# EAGLE design URC-ESP32 (EAGLE 9.6.2)

## Sheet 1 of 3
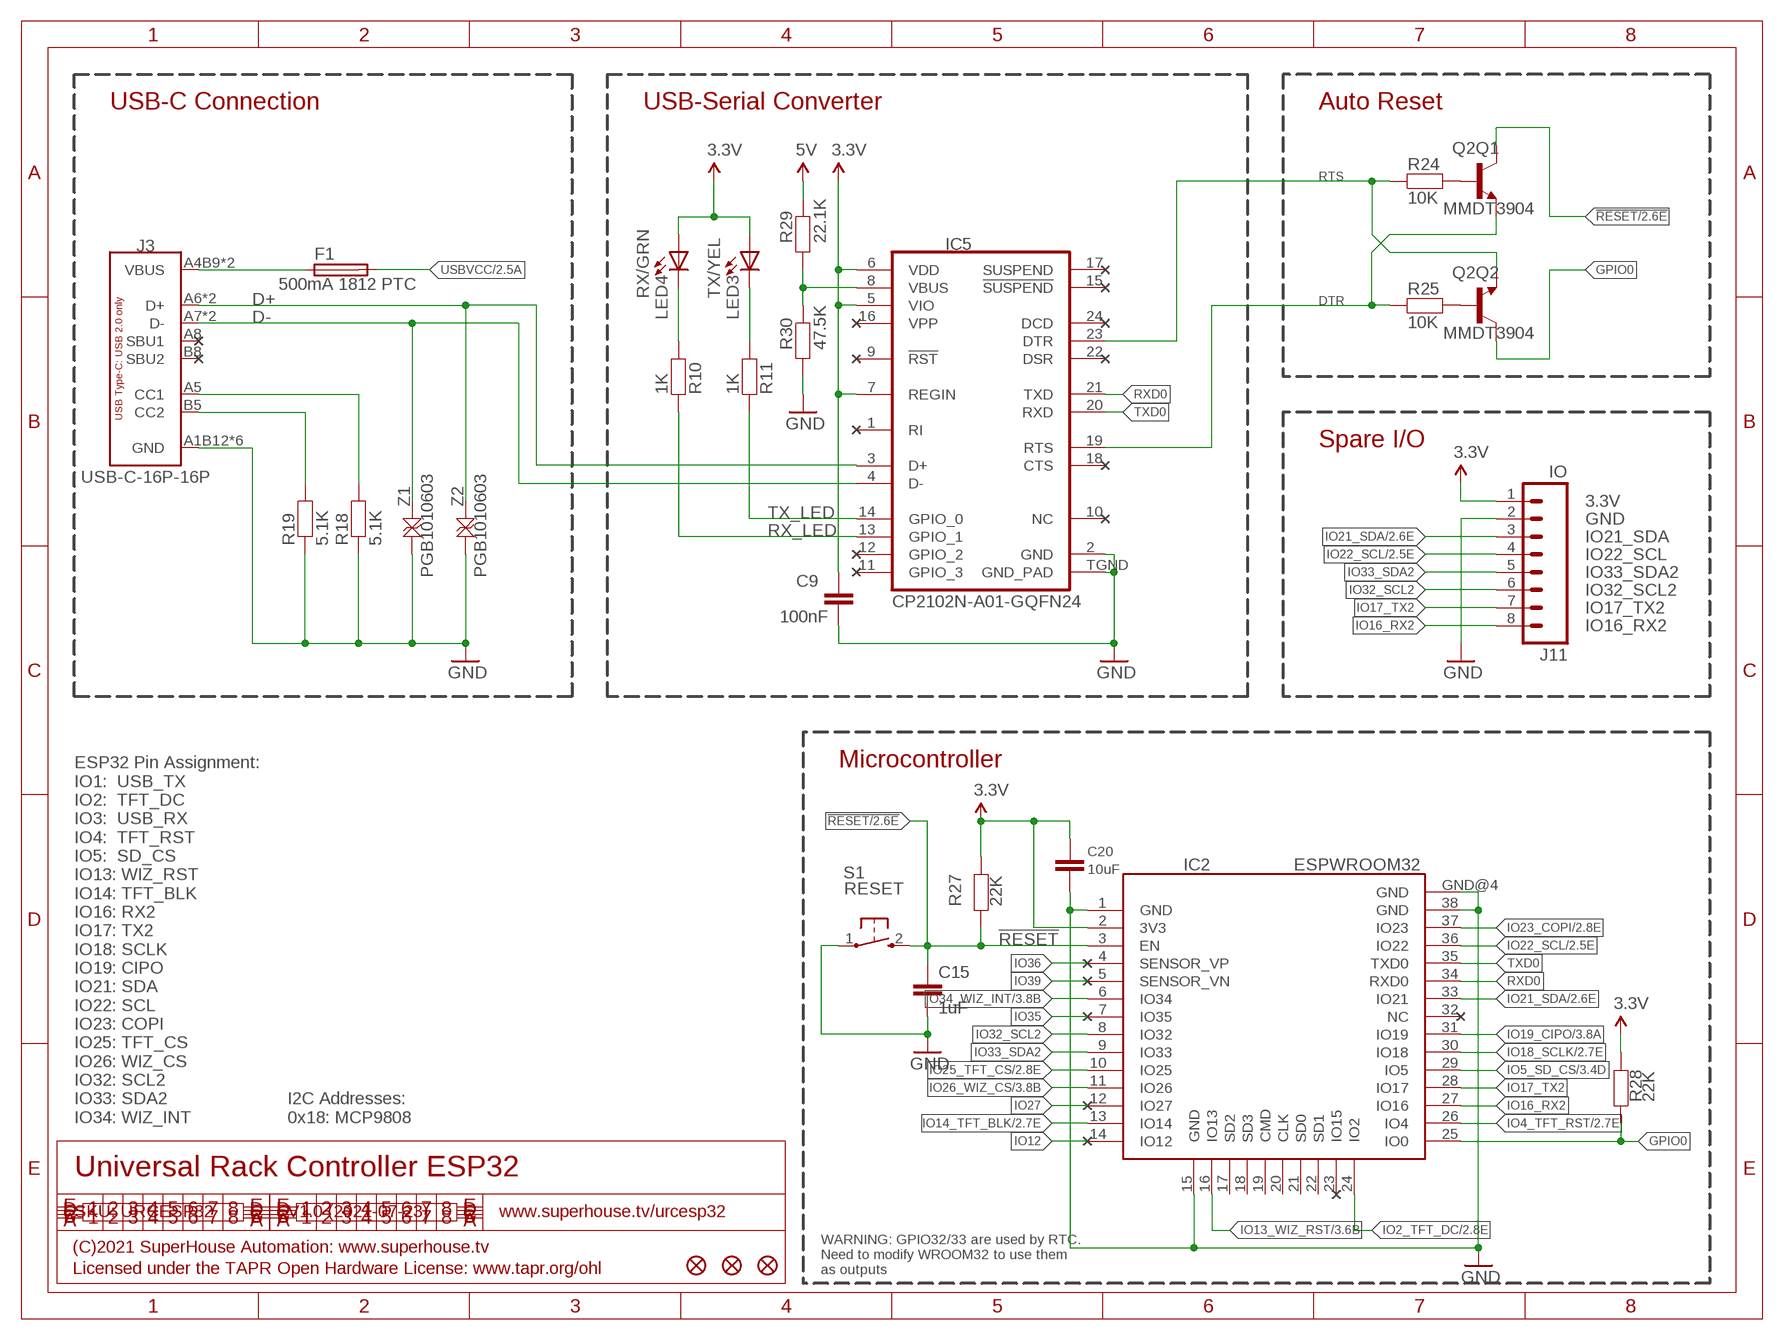
[diagram p0: schematic, sheet 1]

### Parts
C9  100nF  CAP0603  [C0603]
C15  1uF  CAP0603  [C0603]
C20  10uF  CAP0805  [C0805]
F1  500mA 1812 PTC  PTC050-1812  [1812]
FID1  FIDUCIAL1X2.5  [FIDUCIAL-1X2.5]
FID2  FIDUCIAL1X2.5  [FIDUCIAL-1X2.5]
FID3  FIDUCIAL1X2.5  [FIDUCIAL-1X2.5]
IC2  ESPWROOM32  [ESPWROOM32]
IC5  CP2102N-A01-GQFN24  CP2104  [QFN-24]
J3  USB-C-16P-16P  [USB-C-16P]
J11  IO  M08-PLAIN  [1X08]
LED3  TX/YEL  LED0603  [LED-0603]
LED4  RX/GRN  LED0603  [LED-0603]
Q2  MMDT3904  TRANS_NPN_DUAL-MMDT3904  [SOT-363]
R10  1K  RESISTOR0603  [R0603]
R11  1K  RESISTOR0603  [R0603]
R18  5.1K  RESISTOR0603  [R0603]
R19  5.1K  RESISTOR0603  [R0603]
R24  10K  RESISTOR0603  [R0603]
R25  10K  RESISTOR0603  [R0603]
R27  22K  RESISTOR0603  [R0603]
R28  22K  RESISTOR0603  [R0603]
R29  22.1K  RESISTOR0603  [R0603]
R30  47.5K  RESISTOR0603  [R0603]
S1  RESET  TAC_SWITCH_2PINSMT  [TACTILE_SMT_3X4X2]
Z1  PGB1010603  TVS0603  [TVS0603]
Z2  PGB1010603  TVS0603  [TVS0603]

### Nets
3.3V: C9.1 C20.1 IC2.2(3V3) IC5.5(VIO) IC5.6(VDD) IC5.7(REGIN) J11.1 LED3.A LED4.A R27.1 R28.1 ; also sheet 2,3
5V [power]: R29.2 ; also sheet 2
!RESET: C15.1 IC2.3(EN) Q2.3(Q1:C) R27.2 S1.2(S) ; also sheet 2
D+: IC5.3(D+) J3.A6(D+) J3.B6(D+) Z2.2
D-: IC5.4(D-) J3.A7(D-) J3.B7(D-) Z1.2
DTR: IC5.23(DTR) Q2.1(Q2:E) R24.1
GND: C9.2 C15.2 C20.2 IC2.1(GND) IC2.15(GND) IC2.38(GND) IC2.GND@4(GND) IC5.2(GND) IC5.TGND(GND_PAD) J3.A1B12(GND) J3.A12B1(GND) J3.FIX1(GND) J3.FIX2(GND) J3.FIX3(GND) J3.FIX4(GND) J11.2 R18.1 R19.1 R30.1 S1.1(P) Z1.1 Z2.1 ; also sheet 2,3
GPIO0: IC2.25(IO0) Q2.6(Q2:C) R28.2
IO2_TFT_DC: IC2.24(IO2) ; also sheet 2
IO4_TFT_RST: IC2.26(IO4) ; also sheet 2
IO5_SD_CS: IC2.29(IO5) ; also sheet 3
IO12: IC2.14(IO12)
IO13_WIZ_RST: IC2.16(IO13) ; also sheet 3
IO14_TFT_BLK: IC2.13(IO14) ; also sheet 2
IO16_RX2: IC2.27(IO16) J11.8
IO17_TX2: IC2.28(IO17) J11.7
IO18_SCLK: IC2.30(IO18) ; also sheet 2,3
IO19_CIPO: IC2.31(IO19) ; also sheet 3
IO21_SDA: IC2.33(IO21) J11.3 ; also sheet 2
IO22_SCL: IC2.36(IO22) J11.4 ; also sheet 2
IO23_COPI: IC2.37(IO23) ; also sheet 2,3
IO25_TFT_CS: IC2.10(IO25) ; also sheet 2
IO26_WIZ_CS: IC2.11(IO26) ; also sheet 3
IO27: IC2.12(IO27)
IO32_SCL2: IC2.8(IO32) J11.6
IO33_SDA2: IC2.9(IO33) J11.5
IO34_WIZ_INT: IC2.6(IO34) ; also sheet 3
IO35: IC2.7(IO35)
IO36: IC2.4(SENSOR_VP)
IO39: IC2.5(SENSOR_VN)
N$3: Q2.2(Q2:B) R25.2
N$4: J3.B5(CC2) R19.2
N$6: J3.A5(CC1) R18.2
N$7: Q2.5(Q1:B) R24.2
N$21: LED3.C R11.2
N$22: LED4.C R10.2
N$45: IC5.8(VBUS) R29.1 R30.2
RTS: IC5.19(RTS) Q2.4(Q1:E) R25.1
RX_LED: IC5.13(GPIO_1) R10.1
RXD0: IC2.34(RXD0) IC5.21(TXD)
TX_LED: IC5.14(GPIO_0) R11.1
TXD0: IC2.35(TXD0) IC5.20(RXD)
USBVCC: F1.2 ; also sheet 2
USBVIN: F1.1 J3.A4B9(VBUS) J3.A9B4(VBUS)
Unconnected: IC2.17(SD2) IC2.18(SD3) IC2.19(CMD) IC2.20(CLK) IC2.21(SD0) IC2.22(SD1) IC2.23(IO15) IC2.32(NC) IC5.1(RI) IC5.9(!RST) IC5.10(NC) IC5.11(GPIO_3) IC5.12(GPIO_2) IC5.15(!SUSPEND) IC5.16(VPP) IC5.17(SUSPEND) IC5.18(CTS) IC5.22(DSR) IC5.24(DCD) J3.A8(SBU1) J3.B8(SBU2)

### Notes on the sheet
- USB-C Connection | USB-Serial Converter | Auto Reset
- Spare I/O
- 3.3V
- GND
- IO21_SDA
- IO22_SCL
- IO33_SDA2
- IO32_SCL2
- IO17_TX2
- IO16_RX2
- Microcontroller
- ESP32 Pin Assignment:
  IO1:  USB_TX
  IO2:  TFT_DC
  IO3:  USB_RX
  IO4:  TFT_RST
  IO5:  SD_CS
  IO13: WIZ_RST
  IO14: TFT_BLK
  IO16: RX2
  IO17: TX2
  IO18: SCLK
  IO19: CIPO
  IO21: SDA
  IO22: SCL
  IO23: COPI
  IO25: TFT_CS
  IO26: WIZ_CS
  IO32: SCL2
  IO33: SDA2
  IO34: WIZ_INT
- I2C Addresses:
  0x18: MCP9808
- Universal Rack Controller ESP32
- SKU: URCESP32 | V1.0 (2021-07-23) | www.superhouse.tv/urcesp32
- (C)2021 SuperHouse Automation: www.superhouse.tv
- Licensed under the TAPR Open Hardware License: www.tapr.org/ohl
- WARNING: GPIO32/33 are used by RTC.
  Need to modify WROOM32 to use them
  as outputs

## Sheet 2 of 3
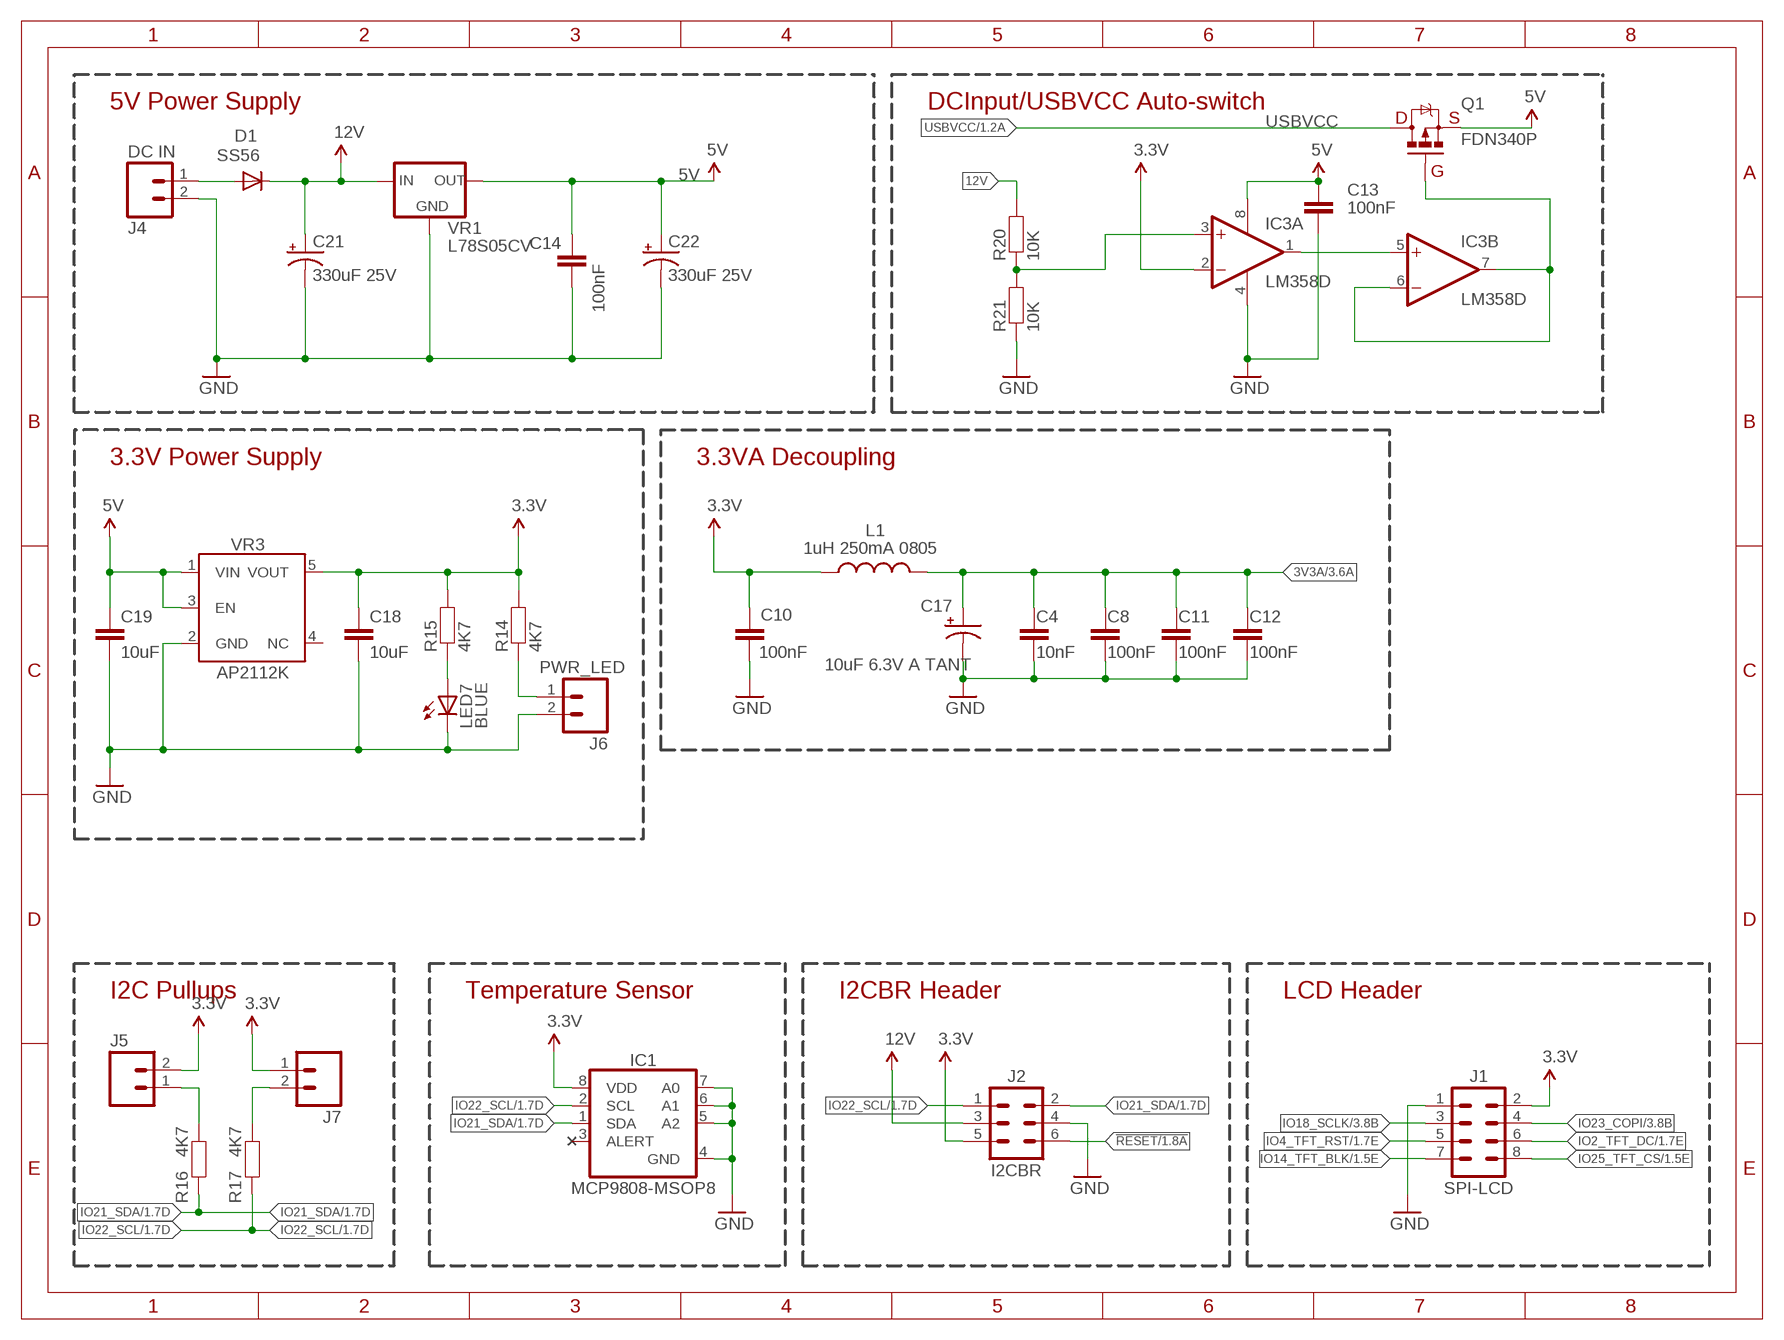
[diagram p1: schematic, sheet 2]

### Parts
C4  10nF  CAP0603  [C0603]
C8  100nF  CAP0603  [C0603]
C10  100nF  CAP0603  [C0603]
C11  100nF  CAP0603  [C0603]
C12  100nF  CAP0603  [C0603]
C13  100nF  CAP0603  [C0603]
C14  100nF  CAP0603  [C0603]
C17  10uF 6.3V A TANT  CAP_POL1206  [EIA3216]
C18  10uF  CAP0805  [C0805]
C19  10uF  CAP0805  [C0805]
C21  330uF 25V  CAP_POLG  [PANASONIC_G]
C22  330uF 25V  CAP_POLG  [PANASONIC_G]
D1  SS56  DIODESMA  [SMA-DIODE]
IC1  MCP9808-MSOP8  [MSOP-8]
IC3  LM358D  [SO08]
J1  SPI-LCD  M02X4-SHROUD  [2X04-2.54-SHROUDED]
J2  I2CBR  M02X3-SHROUDED  [2X3-2.54-SHROUDED]
J4  DC IN  M02-SCREW-3.81MM-HOR  [SCREWTERMINAL-3.81MM-HOR-2]
J5  M02-PIN-JUMP-Y  [1X02-P-JUMP-Y]
J6  PWR_LED  M02-KF2510  [1X02-KF2510]
J7  M02-PIN-JUMP-Y  [1X02-P-JUMP-Y]
L1  1uH 250mA 0805  L-USL2012C  [L2012C]
LED7  BLUE  LED0603  [LED-0603]
Q1  FDN340P  MOSFET-PCHANNEL-SMT  [SOT23-3]
R14  4K7  RESISTOR0603  [R0603]
R15  4K7  RESISTOR0603  [R0603]
R16  4K7  RESISTOR0603  [R0603]
R17  4K7  RESISTOR0603  [R0603]
R20  10K  RESISTOR0603  [R0603]
R21  10K  RESISTOR0603  [R0603]
VR1  L78S05CV  78XX-L78XX-FLAT  [TO220]
VR3  AP2112KSOT25  [SOT23-5]

### Nets
3.3V: C10.1 C18.1 IC1.8(VDD) IC3.2(A:-IN) J1.2 J2.5 J5.2 J7.1 L1.1 R14.2 R15.2 VR3.5(VOUT) ; also sheet 1,3
3V3A: C4.1 C8.1 C11.1 C12.1 C17.A(+) L1.2 ; also sheet 3
5V [power]: C13.1 C14.1 C19.1 C22.+ IC3.8(P:V+) Q1.2(S) VR1.3(OUT) VR3.1(VIN) VR3.3(EN) ; also sheet 1
12V: C21.+ D1.C J2.3 R20.2 VR1.1(IN) ; also sheet 3
!RESET: J2.6 ; also sheet 1
GND: C4.2 C8.2 C10.2 C11.2 C12.2 C13.2 C14.2 C17.C(-) C18.2 C19.2 C21.- C22.- IC1.4(GND) IC1.5(A2) IC1.6(A1) IC1.7(A0) IC3.4(P:V-) J1.1 J2.4 J4.2 J6.2 LED7.C R21.1 VR1.2(GND) VR1.HEATSINK(GND) VR1.TAB(GND) VR3.2(GND) ; also sheet 1,3
IO2_TFT_DC: J1.6 ; also sheet 1
IO4_TFT_RST: J1.5 ; also sheet 1
IO14_TFT_BLK: J1.7 ; also sheet 1
IO18_SCLK: J1.3 ; also sheet 1,3
IO21_SDA: IC1.1(SDA) J2.2 R16.2 ; also sheet 1
IO22_SCL: IC1.2(SCL) J2.1 R17.2 ; also sheet 1
IO23_COPI: J1.4 ; also sheet 1,3
IO25_TFT_CS: J1.8 ; also sheet 1
N$2: LED7.A R15.1
N$5: J6.1 R14.1
N$9: J5.1 R16.1
N$11: J7.2 R17.1
N$12: IC3.3(A:+IN) R20.1 R21.2
N$18: IC3.6(B:-IN) IC3.7(B:OUT) Q1.1(G)
N$19: IC3.1(A:OUT) IC3.5(B:+IN)
N$60: D1.A J4.1
USBVCC: Q1.3(D) ; also sheet 1
Unconnected: IC1.3(ALERT) VR3.4(NC)

### Notes on the sheet
- 5V Power Supply | DCInput/USBVCC Auto-switch
- D | S
- G
- 3.3V Power Supply | 3.3VA Decoupling
- I2C Pullups | Temperature Sensor | I2CBR Header | LCD Header

## Sheet 3 of 3
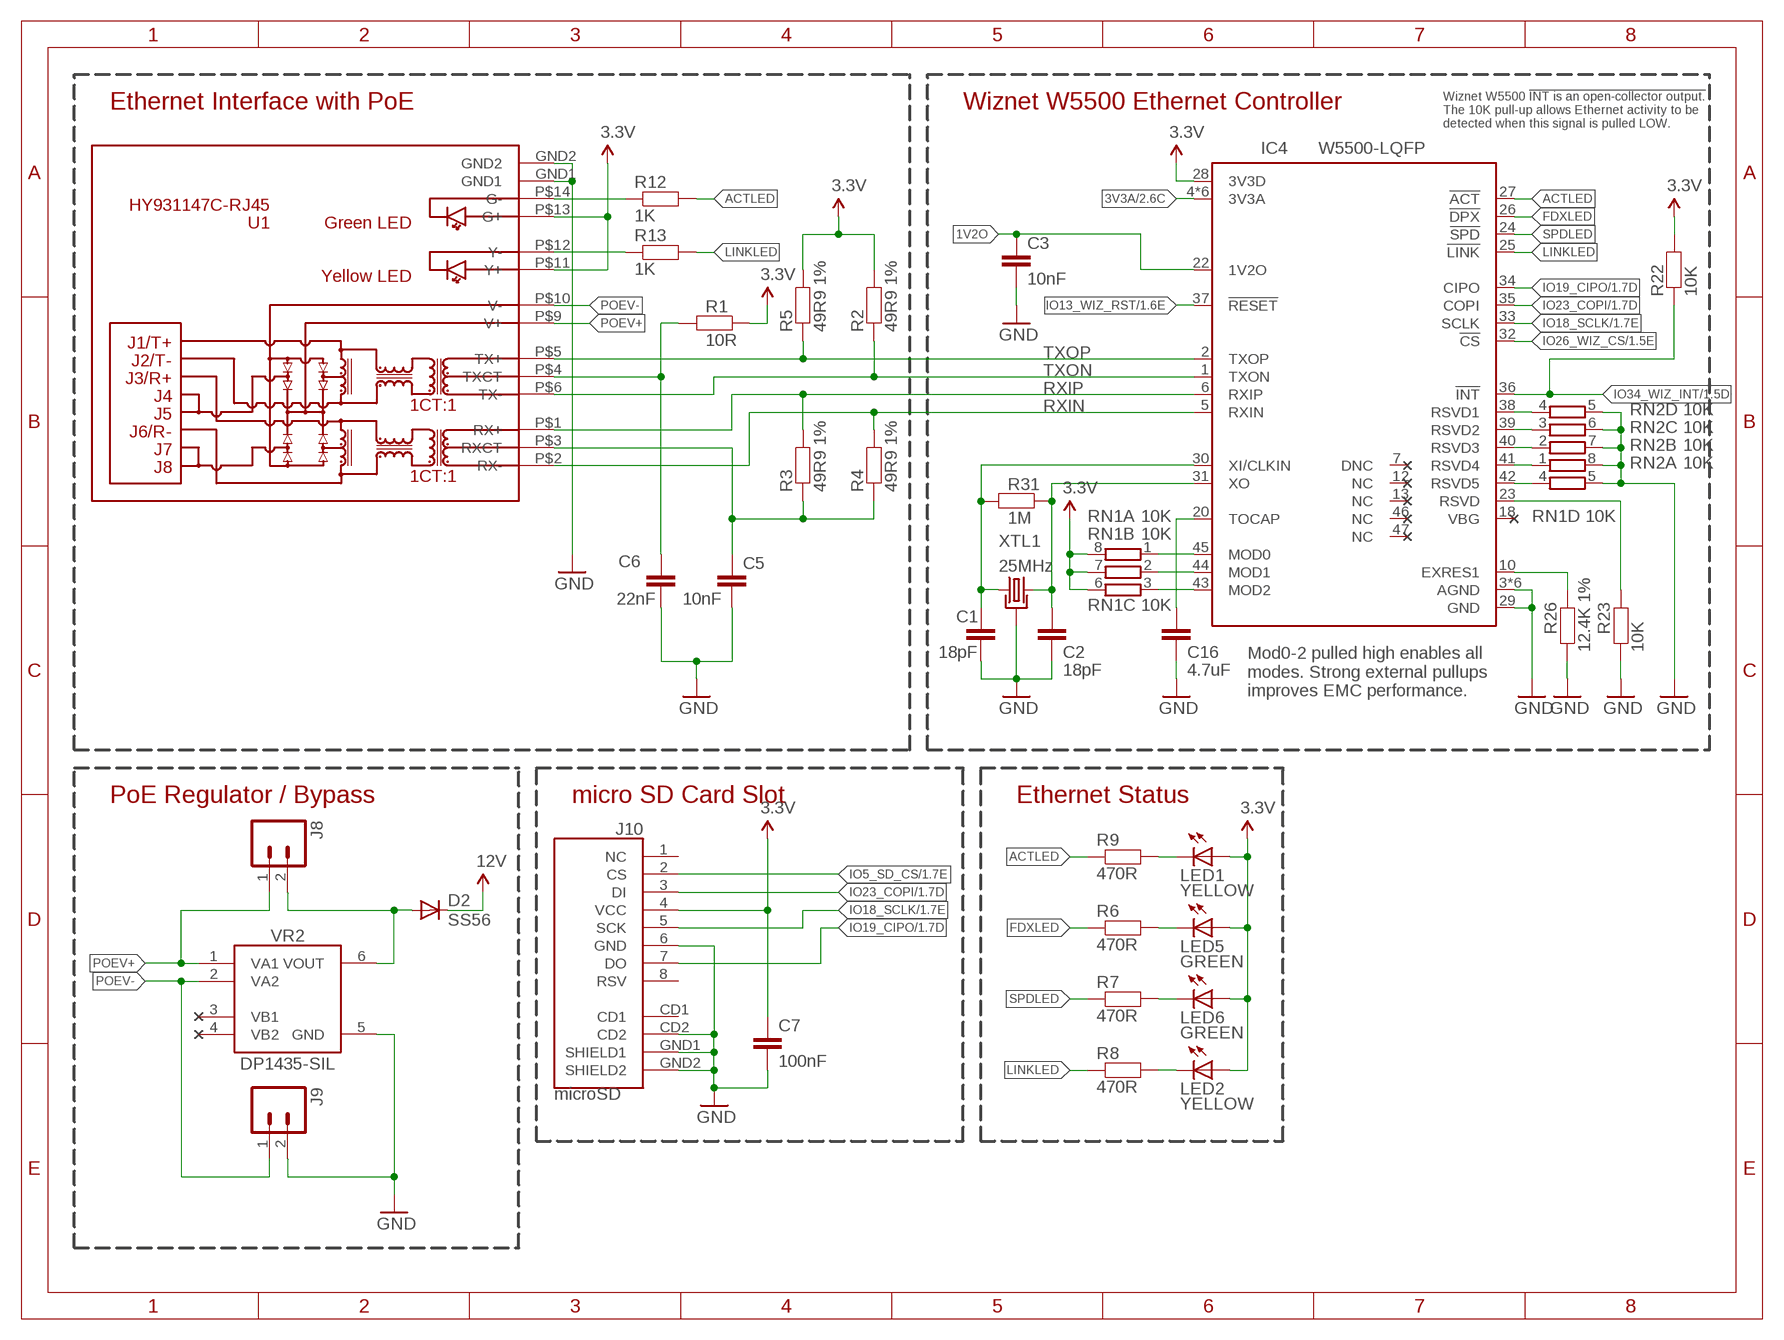
[diagram p2: schematic, sheet 3]

### Parts
C1  18pF  CAP0603  [C0603]
C2  18pF  CAP0603  [C0603]
C3  10nF  CAP0603  [C0603]
C5  10nF  CAP0603  [C0603]
C6  22nF  CAP0603  [C0603]
C7  100nF  CAP0603  [C0603]
C16  4.7uF  CAP0603  [C0603]
D2  SS56  DIODESMA  [SMA-DIODE]
IC4  W5500-LQFP  [LQFP48]
J8  M02-PIN-JUMP-Y  [1X02-P-JUMP-Y]
J9  M02-PIN-JUMP-Y  [1X02-P-JUMP-Y]
J10  microSD  USD-SOCKETNEW  [MICRO-SD-SOCKET-PP]
LED1  YELLOW  LED0603  [LED-0603]
LED2  YELLOW  LED0603  [LED-0603]
LED5  GREEN  LED0603  [LED-0603]
LED6  GREEN  LED0603  [LED-0603]
R1  10R  RESISTOR0603  [R0603]
R2  49R9 1%  RESISTOR0603  [R0603]
R3  49R9 1%  RESISTOR0603  [R0603]
R4  49R9 1%  RESISTOR0603  [R0603]
R5  49R9 1%  RESISTOR0603  [R0603]
R6  470R  RESISTOR0603  [R0603]
R7  470R  RESISTOR0603  [R0603]
R8  470R  RESISTOR0603  [R0603]
R9  470R  RESISTOR0603  [R0603]
R12  1K  RESISTOR0603  [R0603]
R13  1K  RESISTOR0603  [R0603]
R22  10K  RESISTOR0603  [R0603]
R23  10K  RESISTOR0603  [R0603]
R26  12.4K 1%  RESISTOR0603  [R0603]
R31  1M  RESISTOR0603  [R0603]
RN1  10K  4R-NCAY16  [CAY16]
RN2  10K  4R-NCAY16  [CAY16]
U1  HY931147C-RJ45  [HY931147C]
VR2  DP1435-SIL  [DP1435]
XTL1  25MHz  CRYSTAL-GND3X2  [CRYSTAL-SMD-3X2]

### Nets
1V2O: C3.1 IC4.22(1V2O)
3.3V: C7.1 IC4.28(3V3D) J10.4(VCC) LED1.A LED2.A LED5.A LED6.A R1.1 R2.2 R5.2 R22.2 RN1.6 RN1.7 RN1.8 U1.P$11(Y+) U1.P$13(G+) ; also sheet 1,2
3V3A: IC4.4(3V3A) IC4.8(3V3A) IC4.11(3V3A) IC4.15(3V3A) IC4.17(3V3A) IC4.21(3V3A) ; also sheet 2
12V: D2.C ; also sheet 2
ACTLED: IC4.27(!ACT) R9.1 R12.2
FDXLED: IC4.26(!DPX) R6.1
GND: C1.2 C2.2 C3.2 C5.2 C6.2 C7.2 C16.2 IC4.3(AGND) IC4.9(AGND) IC4.14(AGND) IC4.16(AGND) IC4.19(AGND) IC4.29(GND) IC4.48(AGND) J9.2 J10.6(GND) J10.CD2 J10.GND1(SHIELD1) J10.GND2(SHIELD2) R23.2 R26.2 RN1.5 RN2.5 RN2.6 RN2.7 RN2.8 U1.GND1 U1.GND2 VR2.5(GND) XTL1.2(GND) XTL1.4(GND) ; also sheet 1,2
IO5_SD_CS: J10.2(CS) ; also sheet 1
IO13_WIZ_RST: IC4.37(!RESET) ; also sheet 1
IO18_SCLK: IC4.33(SCLK) J10.5(SCK) ; also sheet 1,2
IO19_CIPO: IC4.34(CIPO) J10.7(DO) ; also sheet 1
IO23_COPI: IC4.35(COPI) J10.3(DI) ; also sheet 1,2
IO26_WIZ_CS: IC4.32(!CS) ; also sheet 1
IO34_WIZ_INT: IC4.36(!INT) R22.1 ; also sheet 1
LINKLED: IC4.25(!LINK) R8.1 R13.2
N$1: C5.1 R3.1 R4.1 U1.P$3(RXCT)
N$8: D2.A J8.2 VR2.6(VOUT)
N$10: C2.1 IC4.31(XO) R31.1 XTL1.3
N$26: LED6.C R7.2
N$27: C1.1 IC4.30(XI/CLKIN) R31.2 XTL1.1
N$28: LED2.C R8.2
N$31: C16.1 IC4.20(TOCAP)
N$32: C6.1 R1.2 U1.P$4(TXCT)
N$33: IC4.10(EXRES1) R26.1
N$34: IC4.23(RSVD) R23.1
N$36: IC4.45(MOD0) RN1.1
N$37: IC4.44(MOD1) RN1.2
N$38: IC4.43(MOD2) RN1.3
N$39: IC4.42(RSVD5) RN1.4
N$40: IC4.41(RSVD4) RN2.1
N$41: IC4.40(RSVD3) RN2.2
N$42: IC4.39(RSVD2) RN2.3
N$43: IC4.38(RSVD1) RN2.4
N$67: R12.1 U1.P$14(G-)
N$327: LED5.C R6.2
N$329: LED1.C R9.2
N$332: R13.1 U1.P$12(Y-)
POEV+: J8.1 U1.P$9(V+) VR2.1(VA1)
POEV-: J9.1 U1.P$10(V-) VR2.2(VA2)
RXIN: IC4.5(RXIN) R4.2 U1.P$2(RX-)
RXIP: IC4.6(RXIP) R3.2 U1.P$1(RX+)
SPDLED: IC4.24(!SPD) R7.1
TXON: IC4.1(TXON) R2.1 U1.P$6(TX-)
TXOP: IC4.2(TXOP) R5.1 U1.P$5(TX+)
Unconnected: IC4.7(DNC) IC4.12(NC) IC4.13(NC) IC4.18(VBG) IC4.46(NC) IC4.47(NC) J10.1(NC) J10.8(RSV) J10.CD1

### Notes on the sheet
- Ethernet Interface with PoE | Wiznet W5500 Ethernet Controller
- Wiznet W5500 !INT is an open-collector output.
  The 10K pull-up allows Ethernet activity to be
  detected when this signal is pulled LOW.
- Mod0-2 pulled high enables all
  modes. Strong external pullups
  improves EMC performance.
- PoE Regulator / Bypass | micro SD Card Slot | Ethernet Status

## Power pins joined to a net without a drawn wire
VB1: VR2.3(VB1)
VB2: VR2.4(VB2)

## Library data of the parts
C1-C16 C18-C20 = SuperHouse-Capacitors:CAP: Capacitor Standard ceramic capacitor
C17 C21 C22 = SuperHouse-Capacitors:CAP_POL: Capacitor Polarized These are standard SMD and PTH capacitors. Normally 10uF, 47uF, and 100uF in electrolytic and tantalum varieties. Always verify the external diameter of the through hole cap, it varies with capacity, voltage, and manufacturer. The EIA devices should be standard.
D1 D2 = SuperHouse-Diodes:DIODE: Diode Standard reverse protection diodes and small signal diodes. SMA package can handle up to about 1A. SOD-323 can handle about 200mA.
F1 = SuperHouse-Fuses:PTC: Resettable polyfuses
FID1-FID3 = SuperHouse-Symbols:FIDUCIAL: Fiducial Alignment Points Various fiducial points for machine vision alignment.
IC1 = SuperHouse-Sensors:MCP9808: Microchip MCP9808 I2C temperature sensor
IC2 = SuperHouse-MCUs:ESPWROOM32: Espressif WROOM32 ESP32 module
IC3 = SuperHouse-ICs:LM358: OP AMP also LM158; LM258; LM2904 Source: http://cache.national.com/ds/LM/LM158.pdf
IC4 = SuperHouse-ICs:W5500
IC5 = SuperHouse-ICs:CP2104: CP2104 / CP2102N-A01-GQFN24 CP2104 USB to serial converter. The CP2104 is not recommended for new designs: replace with CP2102N-A01-GQFN24.
J1 = SuperHouse-Connectors:M02X4: M08 header in 2x4 format
J2 = SuperHouse-Connectors:M02X3: M6 header in 2x3 format
J3 = SuperHouse-Connectors:USB-C-16P: USB-C socket with 16 pins, suitable only for backward compatibility with USB 2
J4-J9 = SuperHouse-Connectors:M02: 2-way header Standard 1x2 header, and screw terminal variations
J10 = SuperHouse-Connectors:USD-SOCKET: microSD Socket Push-push type uSD socket. Schematic element and footprint production proven. Spark Fun Electronics SKU : PRT-00127. tDoc lines correctly indicate media card edge positions when inserting (unlocked, locked, depressed).
J11 = SuperHouse-Connectors:M08: 8-way header Standard 1x8 header, and screw terminal variations
L1 = rcl:L-US: INDUCTOR, American symbol; SPICEPREFIX: L
LED1-LED7 = SuperHouse-LEDs:LED: LEDs in various sizes including 5mm and 3mm PTH, and 0402, 0603, 0805, etc SMT
Q1 = SuperHouse-Transistors:MOSFET-PCHANNEL: P-channel MOSFET
Q2 = SuperHouse-Transistors:TRANS_NPN_DUAL: MMDT3904 Dual 3904 NPN transistors. Datasheet <http://www.onsemi.com/pub_link/Collateral/MBT3904DW1T1-D.PDF>; PROD_ID: TRANS-13337
R1-R31 = SuperHouse-Resistors:RESISTOR: Resistors in both surface-mount and through-hole versions.
RN1 RN2 = SuperHouse-Resistors:4R-N: Array Chip Resistor Source: RS Component / Phycomp
S1 = SuperHouse-Switches:TAC_SWITCH_2PIN: Momentary Tactile Switch - 2 pin Uxcell 3x4x2mm switch with 2 SMT pads
U1 = SuperHouse-Connectors:HY931147C: Hanrun RJ45 socket HY931147C
VR1 = SuperHouse-Regulators:78XX: L78xx (linear) and K78xx (switching) voltage regulators
VR2 = SuperHouse-Regulators:DP1435: SDAPO DP1435 12V PoE regulator
VR3 = SuperHouse-Regulators:AP2112K: AP2112K LDO linear voltage regulator
XTL1 = SuperHouse-Oscillators:CRYSTAL-GND: 3x2mm SMT crystal
Z1 Z2 = SuperHouse-Diodes:TVS: TVS voltage protection Zener

## Board
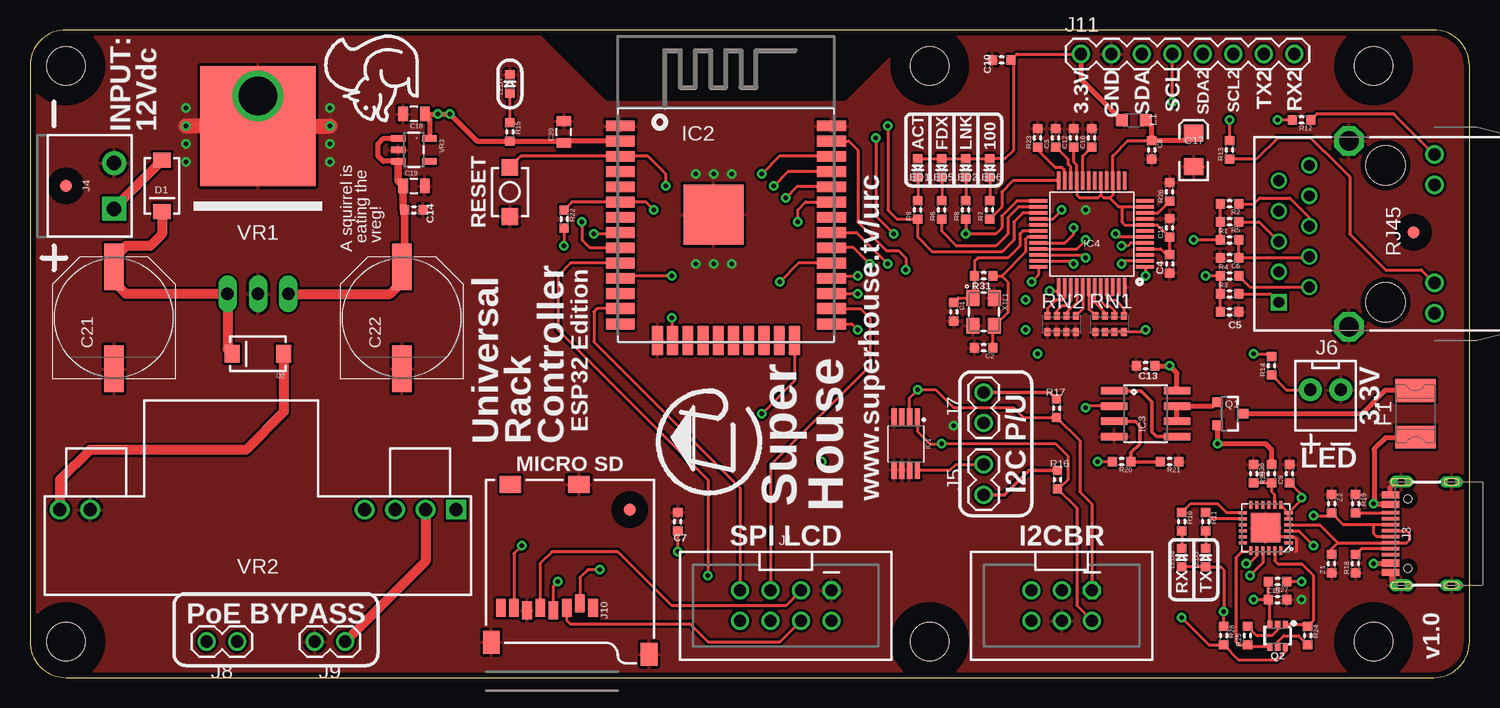
[diagram p3: board, top side]
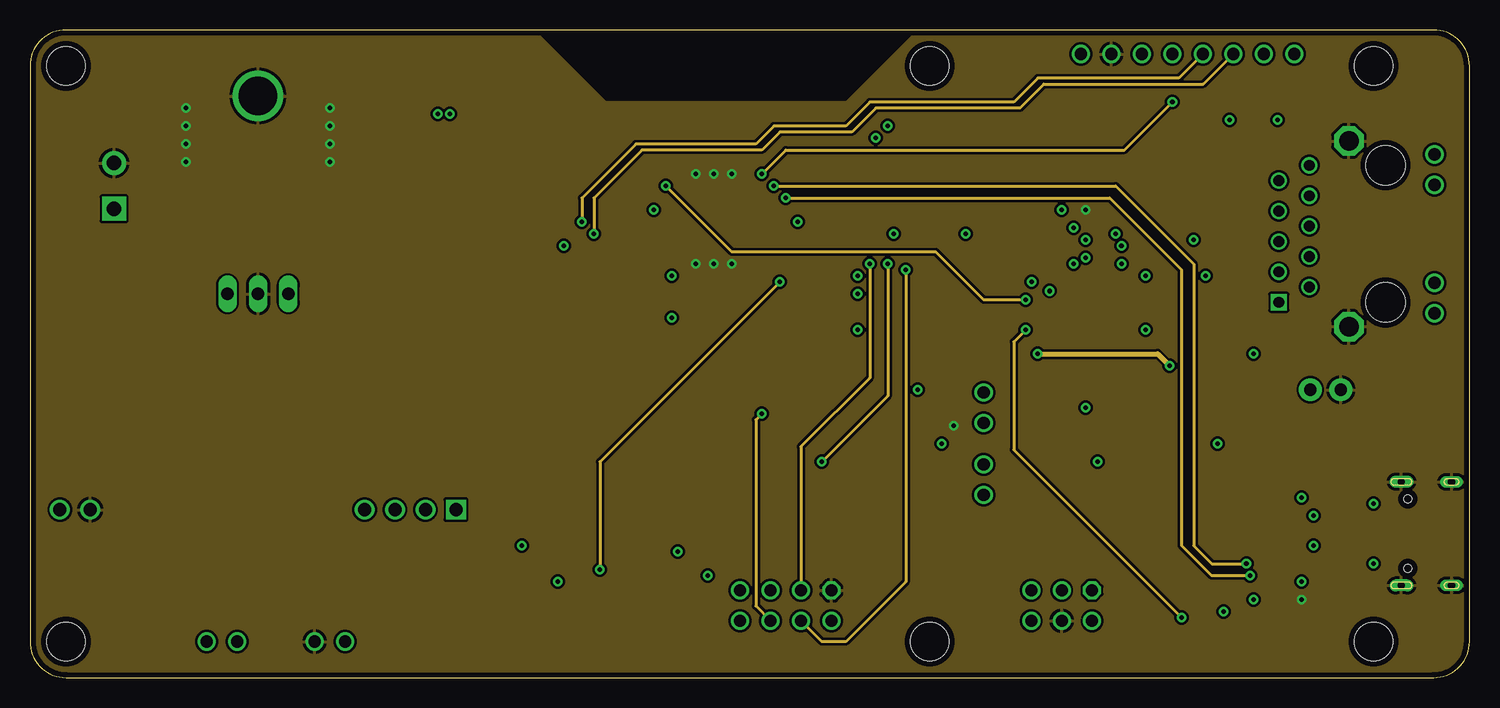
[diagram p4: board, inner layer Route2]
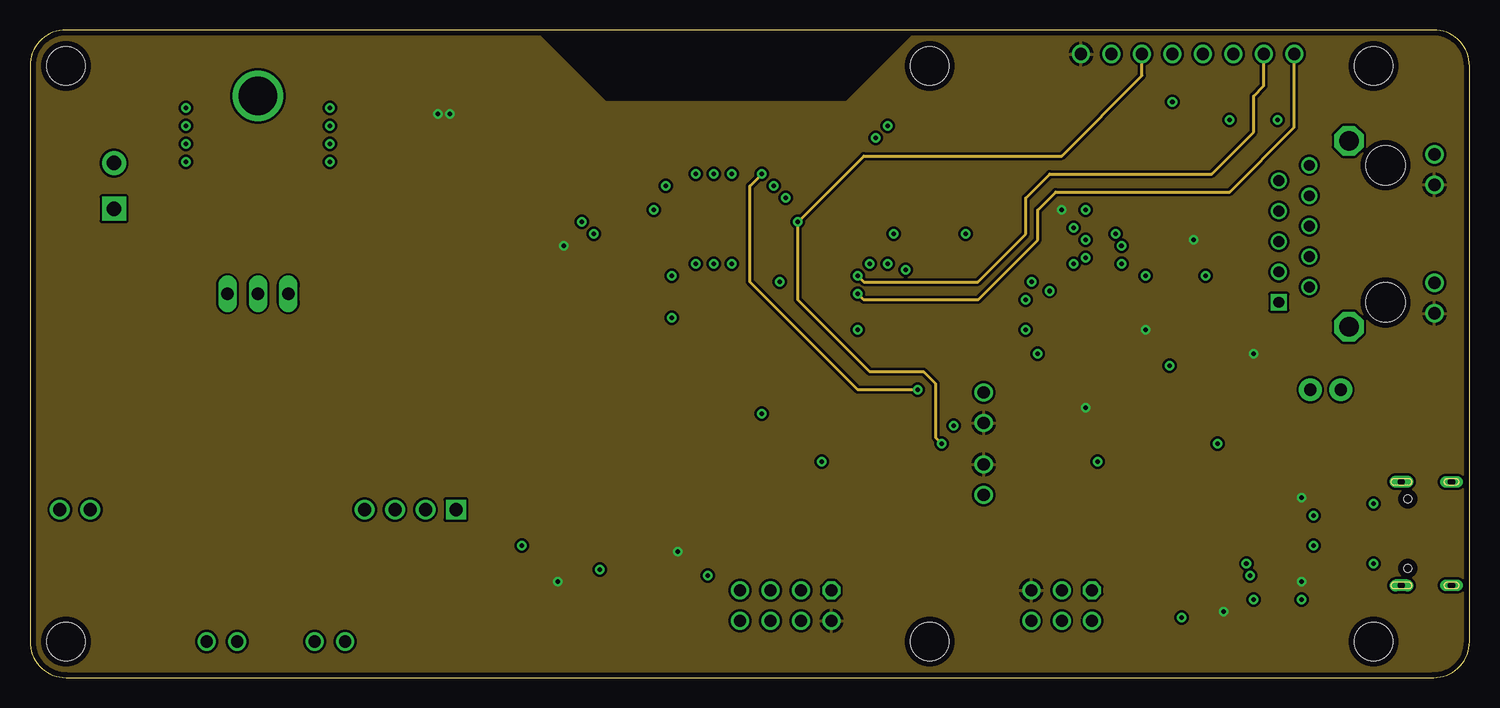
[diagram p5: board, inner layer Route15]
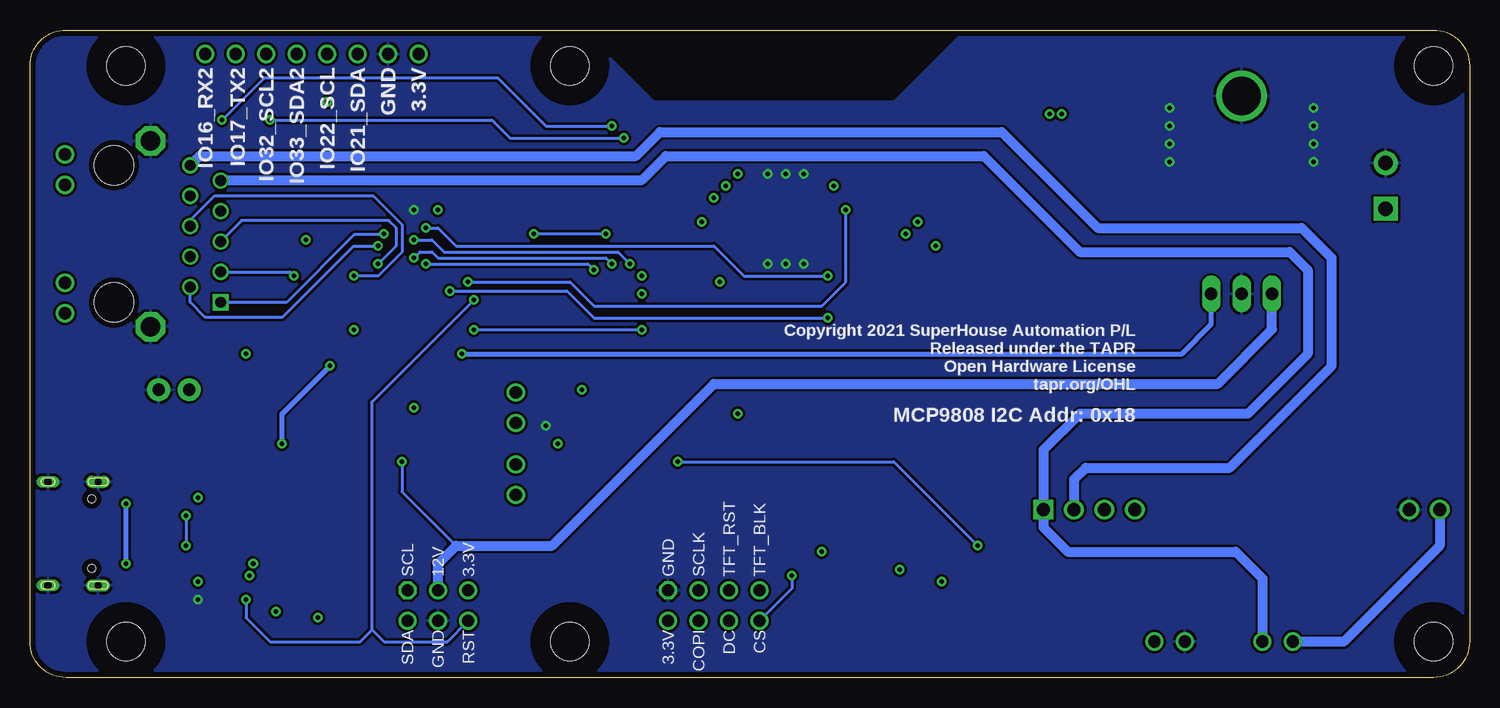
[diagram p6: board, bottom side, seen from below]

Size 120 x 54 mm. Coordinates in mm from the lower left corner, seen from the top.
Outline: 120,51 arc90 117,54 3,54 arc90 0,51 0,3 arc90 3,0 117,0 arc92 120,3 120,51
Copper layers (1+2*15+16): Top 0.035mm / dielectric 1.5mm / Route2 0.035mm / dielectric 0.15mm / Route15 0.035mm / dielectric 0.2mm / Bottom 0.035mm
Design rules "SuperHouse-Design-Rules *": minimum track width 10mil, minimum drill 24mil, track to track 8mil, track to pad 8mil, pad to pad 8mil, via to via 8mil, smd to smd 6mil, copper to edge 18mil, drill to drill 8mil, minimum pad ring 7mil, minimum via ring 8mil, stop-mask expansion 4mil, vias tented up to drill 0.5mm, thermal gap 10mil
Holes 3.2 mm at 112,51 112,3 75,3 75,51 3,3 3,51
tRestrict: area 2,40 to 4,42; area 49,13 to 51,15; area 114.3,36.1 to 116.3,38.1; area 71.8,47.8 to 78.2,54.2; area 108.8,47.8 to 115.2,54.2; area 108.8,-0.2 to 115.2,6.2; area 71.8,-0.2 to 78.2,6.2; area -0.2,-0.2 to 6.2,6.2; area -0.2,47.8 to 6.2,54.2
bRestrict: area 71.8,47.8 to 78.2,54.2; area 71.8,-0.2 to 78.2,6.2; area -0.2,47.8 to 6.2,54.2; area -0.2,-0.2 to 6.2,6.2; area 108.8,47.8 to 115.2,54.2; area 108.8,-0.2 to 115.2,6.2

### Footprints (pad centres in the part's own frame; a part is rotated, then mirrored left to right if it is on the bottom)
C0603 = smd 0.762 x 0.762: 1 -0.762,0; 2 0.762,0
EIA3216 = smd 1.4 x 1.6: A 1.4,0; C -1.4,0
C0805 = smd 0.8 x 1.2: 1 -0.9,0; 2 0.9,0
PANASONIC_G = smd 3.9 x 1.6: + 4.25,0; - -4.25,0
SMA-DIODE = smd 1.27 x 1.47: A -2.15,0; C 2.15,0
1812 = smd 1.9 x 3.4: 1 -1.95,0; 2 1.95,0
FIDUCIAL-1X2.5 = smd 1 x 1: 1 0,0
MSOP-8 = smd 1.45 x 0.45: 1 -2.2,0.975; 2 -2.2,0.325; 3 -2.2,-0.325; 4 -2.2,-0.975; 5 2.2,-0.975; 6 2.2,-0.325; 7 2.2,0.325; 8 2.2,0.975
ESPWROOM32 = smd 2.4 x 0.9: 1 -8.8,-1.5; 2 -8.8,-2.77; 3 -8.8,-4.04; 4 -8.8,-5.31; 5 -8.8,-6.58; 6 -8.8,-7.85; 7 -8.8,-9.12; 8 -8.8,-10.39; 9 -8.8,-11.66; 10 -8.8,-12.93; 11 -8.8,-14.2; 12 -8.8,-15.47; 13 -8.8,-16.74; 14 -8.8,-18.01; 25 8.8,-18.01; 26 8.8,-16.74; 27 8.8,-15.47; 28 8.8,-14.2; 29 8.8,-12.93; 30 8.8,-11.66; 31 8.8,-10.39; 32 8.8,-9.12; 33 8.8,-7.85; 34 8.8,-6.58; 35 8.8,-5.31; 36 8.8,-4.04; 37 8.8,-2.77; 38 8.8,-1.5 | smd 0.9 x 2.4: 15 -5.7,-19.4; 16 -4.43,-19.4; 17 -3.16,-19.4; 18 -1.89,-19.4; 19 -0.62,-19.4; 20 0.65,-19.4; 21 1.92,-19.4; 22 3.19,-19.4; 23 4.46,-19.4; 24 5.73,-19.4 | smd 5 x 5: GND@4 -1.03,-8.89
SO08 = smd 0.61 x 2.21: 1 -1.905,-2.616; 2 -0.635,-2.616; 3 0.635,-2.616; 4 1.905,-2.616; 5 1.905,2.616; 6 0.635,2.616; 7 -0.635,2.616; 8 -1.905,2.616
LQFP48 = smd 1.5 x 0.3: 1 -4.45,2.75; 2 -4.45,2.25; 3 -4.45,1.75; 4 -4.45,1.25; 5 -4.45,0.75; 6 -4.45,0.25; 7 -4.45,-0.25; 8 -4.45,-0.75; 9 -4.45,-1.25; 10 -4.45,-1.75; 11 -4.45,-2.25; 12 -4.45,-2.75; 25 4.45,-2.75; 26 4.45,-2.25; 27 4.45,-1.75; 28 4.45,-1.25; 29 4.45,-0.75; 30 4.45,-0.25; 31 4.45,0.25; 32 4.45,0.75; 33 4.45,1.25; 34 4.45,1.75; 35 4.45,2.25; 36 4.45,2.75 | smd 0.3 x 1.5: 13 -2.75,-4.45; 14 -2.25,-4.45; 15 -1.75,-4.45; 16 -1.25,-4.45; 17 -0.75,-4.45; 18 -0.25,-4.45; 19 0.25,-4.45; 20 0.75,-4.45; 21 1.25,-4.45; 22 1.75,-4.45; 23 2.25,-4.45; 24 2.75,-4.45; 37 2.75,4.45; 38 2.25,4.45; 39 1.75,4.45; 40 1.25,4.45; 41 0.75,4.45; 42 0.25,4.45; 43 -0.25,4.45; 44 -0.75,4.45; 45 -1.25,4.45; 46 -1.75,4.45; 47 -2.25,4.45; 48 -2.75,4.45
QFN-24 = smd 0.25 x 0.7: 1 -1.25,-1.9; 2 -0.75,-1.9; 3 -0.25,-1.9; 4 0.25,-1.9; 5 0.75,-1.9; 6 1.25,-1.9; 13 1.25,1.9; 14 0.75,1.9; 15 0.25,1.9; 16 -0.25,1.9; 17 -0.75,1.9; 18 -1.25,1.9 | smd 0.7 x 0.25: 7 1.9,-1.25; 8 1.9,-0.75; 9 1.9,-0.25; 10 1.9,0.25; 11 1.9,0.75; 12 1.9,1.25; 19 -1.9,1.25; 20 -1.9,0.75; 21 -1.9,0.25; 22 -1.9,-0.25; 23 -1.9,-0.75; 24 -1.9,-1.25 | smd 2.45 x 2.45: TGND 0,0
2X04-2.54-SHROUDED = drill 1 octagon: 1 -3.81,-1.27 | drill 1: 2 -3.81,1.27; 3 -1.27,-1.27; 4 -1.27,1.27; 5 1.27,-1.27; 6 1.27,1.27; 7 3.81,-1.27; 8 3.81,1.27
2X3-2.54-SHROUDED = drill 1 octagon: 1 -2.54,-1.27 | drill 1: 2 -2.54,1.27; 3 0,-1.27; 4 0,1.27; 5 2.54,-1.27; 6 2.54,1.27
USB-C-16P = smd 0.6 x 1.45: A1B12 -3.225,5.095; A4B9 -2.45,5.095; A9B4 2.45,5.095; A12B1 3.225,5.095 | smd 0.3 x 1.45: A5 -1.25,5.095; A6 -0.25,5.095; A7 0.25,5.095; A8 1.25,5.095; B5 1.75,5.095; B6 0.75,5.095; B7 -0.75,5.095; B8 -1.75,5.095 | drill 0.6 pad 0.8 long: FIX1 -4.32,0; FIX4 4.32,0 | drill 0.6 pad 1 long: FIX2 -4.32,4.18; FIX3 4.32,4.18 | hole 0.65: 2.89,3.65; -2.89,3.65
SCREWTERMINAL-3.81MM-HOR-2 = drill 1.2 pad 2 square: 1 -1.905,0 | drill 1.2 pad 2: 2 1.908,0
1X02-P-JUMP-Y = drill 1.016: 1 -1.27,0; 2 1.27,0
1X02-KF2510 = drill 1.016 pad 1.88: 1 -1.27,0; 2 1.27,0
MICRO-SD-SOCKET-PP = smd 0.8 x 1.5: 1 -8.94,10.7; 2 -7.84,10.3; 3 -6.74,10.7; 4 -5.64,10.9; 5 -4.54,10.7; 6 -3.44,10.9; 7 -2.34,10.7; 8 -1.24,10.7 | smd 1.8 x 1.4: CD1 -2.05,0.4; CD2 -7.75,0.4 | smd 1.4 x 1.9: GND1 -0.45,13.55; GND2 -13.6,14.55
1X08 = drill 1.016: 1 -8.89,0; 2 -6.35,0; 3 -3.81,0; 4 -1.27,0; 5 1.27,0; 6 3.81,0; 7 6.35,0; 8 8.89,0
L2012C = smd 1 x 1: 1 -1,0; 2 1,0
LED-0603 = smd 0.762 x 0.762: A -0.762,0; C 0.762,0
SOT23-3 = smd 0.8 x 0.9: 1 -0.95,-1; 2 0.95,-1; 3 0,1.1
SOT-363 = smd 0.42 x 0.6: 1 -0.65,-0.95; 2 0,-0.95; 3 0.65,-0.95; 4 0.65,0.95; 5 0,0.95; 6 -0.65,0.95
R0603 = smd 0.762 x 0.762: 1 -0.762,0; 2 0.762,0
CAY16 = smd 0.5 x 0.65: 1 -1.2,-0.675; 2 -0.4,-0.675; 3 0.4,-0.675; 4 1.2,-0.675; 5 1.2,0.675; 6 0.4,0.675; 7 -0.4,0.675; 8 -1.2,0.675
TACTILE_SMT_3X4X2 = smd 1.4 x 1.4: 1 -2.05,0; 2 2.05,0
HY931147C = drill 1.63 octagon: GND1 3.05,7.745; GND2 3.05,-7.745 | drill 0.9 square: P$1 8.89,5.715 | drill 0.9: P$2 6.35,4.445; P$3 8.89,3.175; P$4 6.35,1.905; P$5 8.89,0.635; P$6 6.35,-0.635; P$7 8.89,-1.905; P$8 6.35,-3.175; P$9 8.89,-4.445; P$10 6.35,-5.715 | drill 1.016: P$11 -4.08,6.625; P$12 -4.08,4.085; P$13 -4.08,-4.085; P$14 -4.08,-6.625 | hole 3.25: 0,5.715; 0,-5.715
TO220 = drill 1.016 long: 1 -2.54,0; 2 0,0; 3 2.54,0 | smd 9.6 x 10: HEATSINK 0,14 | drill 3.2: TAB 0,16.5
DP1435 = drill 1.1 square: 1 -16.51,0 | drill 1.1: 2 -13.97,0; 3 -11.43,0; 4 -8.89,0; 5 13.97,0; 6 16.51,0
SOT23-5 = smd 0.55 x 1.2: 1 -0.95,-1.3; 2 0,-1.3; 3 0.95,-1.3; 4 0.95,1.3; 5 -0.95,1.3
CRYSTAL-SMD-3X2 = smd 1.3 x 1.1: 1 -1.15,-0.9; 2 1.15,-0.9; 3 1.15,0.9; 4 -1.15,0.9
TVS0603 = smd 0.762 x 0.762: 1 -0.762,0; 2 0.762,0

### Placement (x,y rotation side)
C1  77,30.5 270 top
C2  79.5,27.5 180 top
C3  85.5,45 90 top
C4  95,34.5 270 top
C5  100,30.5 0 top
C6  100,35 180 top
C7  54,13 90 top
C8  93.5,44 270 top
C9  105,17 90 top
C10  81,51.5 180 top
C11  95,37.5 90 top
C12  87,45 90 top
C13  93,26 180 top
C14  32,39 0 top
C15  104,6.5 0 top
C16  88.5,45 90 top
C17  97,44 90 top
C18  32,47 180 top
C19  32,41 0 top
C20  44.5,45.5 90 top
C21  7,30 90 top
C22  31,30 90 top
D1  11,41 270 top
D2  19,27 180 top
F1  115.5,22 90 top
FID1  3,41 180 top
FID2  50,14 180 top
FID3  115.33,37.12 180 top
IC1  73,19.5 270 top
IC2  58,47.5 0 top
IC3  93,22 270 top
IC4  88.5,37 180 top
IC5  103,12.5 90 top
J1  63,6 180 top
J2  86,6 180 top
J3  118.5,12 90 top
J4  7,41 90 top
J5  79.5,16.5 90 top
J6  108,24 0 top
J7  79.5,22.5 90 top
J8  16,3 180 top
J9  25,3 180 top
J10  38,16.5 180 top
J11  96.5,52 0 top
L1  92,46.5 0 top
LED1  74,42.5 270 top
LED2  78,42.5 270 top
LED3  98,10 90 top
LED4  96,10 90 top
LED5  76,42.5 270 top
LED6  80,42.5 270 top
LED7  40,49.5 90 top
Q1  100,22 270 top
Q2  104,3.5 180 top
R1  100,36.5 0 top
R2  100,39.5 180 top
R3  100,32 0 top
R4  100,33.5 0 top
R5  100,38 180 top
R6  76,39 90 top
R7  80,39 90 top
R8  78,39 90 top
R9  74,39 90 top
R10  96,13 270 top
R11  98,13 270 top
R12  106,46.5 180 top
R13  100,44 90 top
R14  103.5,26 90 top
R15  40,45.5 270 top
R16  85.65,16.5 270 top
R17  85.57,22.46 270 top
R18  110.5,9.5 90 top
R19  110.5,14.5 270 top
R20  91,18 180 top
R21  95,18 180 top
R22  44.53,38.23 270 top
R23  84,45 90 top
R24  106.5,3.5 270 top
R25  101.5,3.5 90 top
R26  95,40.5 90 top
R27  104,8 180 top
R28  99.5,3.5 270 top
R29  103.5,17 90 top
R30  102,17 270 top
R31  79.5,33.5 180 top
RN1  90,29.5 180 top
RN2  86,29.5 180 top
S1  40,40.5 90 top
U1  113,37 180 top
VR1  19,32 0 top
VR2  19,14 180 top
VR3  32,44 270 top
XTL1  79.5,30.5 270 top
Z1  108.5,9.5 90 top
Z2  108.5,14.5 270 top

### Tracks (layer width: path | path; a pad name or v marks a point on that pad's centre or on a via)
1V2O
  Top 0.254: C3.1 86.54,43.2 86.54,42.81 86.75,42.6 IC4.22
3.3V  (via drill 0.4)
  Top 0.254: RN1.6 RN1.7 RN1.8 92.83,28.82 v93,29 | IC5.5 IC5.6 | IC5.6 IC5.7 | LED4.A LED3.A 99.26,9.24 99.5,9 v99.5,5.5 R28.1 | v106,8 R27.1 | R2.2 R5.2 R1.1 v97,36.5 | LED1.A LED5.A LED2.A LED6.A 81.26,43.26 82,44 82,51.26 C10.1 82.26,52 J11.1 | C9.1 106,15.24 v106,15 106,14.85 IC5.6 | IC3.2 88.14,22.64 v88,22.5 | IC1.8 76.7,17.3 77.17,17.77 J5.2 | v102,27 103.26,27 R14.2 | J10.4 43.64,7.64 v44,8 | v54,10.5 C7.1 | IC4.28 85.25,38.25 v86,39 | R22.2 44.5,37.44 v44.5,36
  Top 0.406: IC2.2 44.63,44.73 | 44.63,44.73 C20.1 | 44.63,44.73 44.62,44.74 R15.2 37.26,44.74 v35,47 v34,47 C18.1 33.3,46.6 VR3.5 | J11.1 87.61,49.89 L1.1
  pour Route15: 117,0 arc90 120,3 120,51 arc90 117,54 74,54 68,48 48,48 42,54 3,54 arc90 0,51 0,3 arc90 3,0
3V3A
  Top 0.254: IC4.17 89.25,40.25 | 89.25,40.25 89.5,40 90,40 | 90,40 90.25,40.25 IC4.15 90.25,43.5 91.51,44.76 C8.1 | C12.1 87,43 87.25,42.75 IC4.21 87.25,40.25 87.5,40 89,40 89.25,40.25 | IC4.11 91,39.25 | 91,39.25 90.75,39.25 90,40 | 91,39.25 91,38 91.25,37.75 IC4.8 93.99,37.75 C11.1 C4.1 94.74,35.26 94.25,35.75 IC4.4
  Top 0.406: C17.A 96.36,44.76 C8.1 93.5,46 L1.2
5V  (via drill 0.4)
  Top 0.406: VR3.1 29.45,44.95 29,44.5 29,43.5 29.45,43.05 VR3.3 | 31.24,34.49 C22.+ | C14.1 31.1,39.14 | C13.1 v95,26 95.62,25.38 IC3.8 | R29.2 103.5,19 103,19.5 v99,19.5 99,20.95 Q1.2
  Top 0.61: C14.1 31.24,34.49 | 31.1,39.14 C19.1 30.7,41.4 VR3.3
  Top 0.813: VR1.3 30,32 31,33 C22.+
  Route2 0.406: v84,27 94,27 v95,26
  Bottom 0.406: v99,19.5 99,22 v95,26 | VR1.3 21.54,29.46 24,27 v84,27
12V  (via drill 0.4)
  Top 0.254: R20.2 v89,18
  Top 0.813: D2.C 16.46,27.39 VR1.1 8,32 7,33 C21.+ 7,35 8,36 10,36 11,37 D1.C
  Bottom 0.254: v89,18 89,15.5 84.5,11
  Bottom 0.813: J2.3 86,9.5 84.5,11 76.5,11 63,24.5 21,24.5 16.46,29.04 VR1.1
!RESET  (via drill 0.4)
  Top 0.254: Q2.3 103.35,6.39 C15.1 | C15.1 R27.2 | C15.1 v102,6.5 | S1.2 40.91,43.46 IC2.3 51.54,43.46 53,42 v53,41
  Route2 0.254: v53,41 58.5,35.5 75.5,35.5 79.5,31.5 v83,31.5
  Bottom 0.254: v102,6.5 102,5 100,3 92.5,3 91.5,4 | J2.6 85.19,3 90.5,3 91.5,4 | 91.5,4 91.5,23 v83,31.5
ACTLED  (via drill 0.4)
  Top 0.254: IC4.27 82.75,38.75 82,38 82,36.5 81,35.5 75.24,35.5 74,36.74 R9.1 72.26,38.24 71.5,39 v71.5,46 | R12.2 v104,46.5
  Bottom 0.254: v71.5,46 77,46 81,50 100.5,50 v104,46.5
D+  (via drill 0.4)
  Top 0.254: J3.B6 112,12.75 | 112,12.75 109.49,12.75 Z2.2 108.26,13.5 v107,13.5 | J3.A6 112.25,11.75 112,12 112,12.75 | IC5.3 105.75,12.25 v107,11
  Bottom 0.254: v107,13.5 v107,11
D-
  Top 0.254: 109.01,11.25 J3.B7 114.75,11.25 115,11.5 115,12 114.75,12.25 J3.A7 | Z1.2 108.5,10.74 109.01,11.25 | 109.01,11.25 107.51,12.75 IC5.4
DTR
  Top 0.254: Q2.1 106.31,4.45 R24.1 107,4.76 107,8.5 106,9.5 104,9.5 103.75,9.75 IC5.23
FDXLED
  Top 0.254: IC4.26 82.4,39.25 81.5,38.35 81.5,37 80.5,36 77.24,36 76,37.24 R6.1
GND  (via drill 0.4)
  Top 0.254: IC5.TGND 103.75,11.75 IC5.2 105.34,11.75 105.58,11.51 105.58,10.58 105.5,10.5
  Top 0.406: J3.A1B12 113.5,8.68 113.5,8 113.82,7.68 J3.FIX2 | J3.A12B1 113.41,15.9 113.82,16.32 J3.FIX3
  Top 1.27: v25,46 VR1.HEATSINK v13,46
  other vias: 57,42 106,6.5 55.5,42 58.5,42 77,21 88,39 57,34.5 58.5,34.5 55.5,34.5 25,44.5 25,47.5 13,47.5 13,44.5 25,43 13,43
  pour Bottom: 120,3 arc-90 117,0 3,0 arc-90 0,3 0,51 arc-90 3,54 42,54 48,48 68,48 74,54 117,54 arc-90 120,51
  pour Route2: 117,0 arc90 120,3 120,51 arc90 117,54 74,54 68,48 48,48 42,54 3,54 arc90 0,51 0,3 arc90 3,0
  pour Top: 120,3 arc-90 117,0 3,0 arc-90 0,3 0,51 arc-90 3,54 42,54 48,48 68,48 74,54 117,54 arc-90 120,51
GPIO0  (via drill 0.4)
  Top 0.254: Q2.6 104.65,2.15 104,1.5 100.74,1.5 R28.2 98.26,2.74 v96,5 | IC2.25 68.51,29.49 v69,29
  Route2 0.254: v83,29 82,28 82,19 v96,5
  Bottom 0.254: v69,29 v83,29
IO2_TFT_DC  (via drill 0.4)
  Top 0.254: IC2.24 63.73,24.73 v61,22
  Route2 0.254: v61,22 60.5,21.5 60.5,5.96 J1.6
IO4_TFT_RST
  Top 0.254: IC2.26 69.24,30.76 70,30 70,26 61.73,17.73 J1.5
IO5_SD_CS  (via drill 0.4)
  Top 0.254: IC2.29 64.07,34.57 v62.5,33 | v47.5,9 46.5,9 45.84,8.34 J10.2
  Route2 0.254: v62.5,33 47.5,18 v47.5,9
IO13_WIZ_RST  (via drill 0.4)
  Top 0.254: v53.5,30 53.5,28.17 IC2.16 | v85,32.23 85.75,32.23 IC4.37
  Bottom 0.254: v85,32.23 75.23,32.23 73,30 v53.5,30
IO14_TFT_BLK
  Top 0.254: IC2.13 47.26,30.76 47,30.5 47,28 59.19,15.81 J1.7
IO16_RX2  (via drill 0.4)
  Top 0.254: IC2.27 68.97,32.03 v69,32
  Route15 0.254: v69,32 69.5,31.5 79,31.5 84,36.5 84,39 85.5,40.5 100,40.5 105.39,45.89 J11.8
IO17_TX2  (via drill 0.4)
  Top 0.254: IC2.28 67,33.5 v69,33.5
  Route15 0.254: v69,33.5 69.5,33 79,33 83,37 83,40 85,42 98.5,42 102,45.5 102,48.5 102.85,49.35 J11.7
IO18_SCLK  (via drill 0.4)
  Top 0.254: J1.3 63,6 53.5,6 49,10.5 43.5,10.5 42.54,9.54 J10.5 | IC4.33 87.25,35.75 v88,36.5 | v70,34.5 68.66,35.84 IC2.30
  Route2 0.254: J1.3 64.27,19.27 70,25 v70,34.5
  Bottom 0.254: v88,36.5 86.5,36.5 85.5,35.5 71,35.5 v70,34.5
IO19_CIPO  (via drill 0.4)
  Top 0.254: IC4.34 87.75,35.25 v88,35 | IC2.31 68.89,37.11 v71.5,34.5 | v41,11 40.34,10.34 J10.7
  Route2 0.254: v71.5,34.5 71.5,23.5 v66,18
  Bottom 0.254: v88,35 87.5,35.5 86.5,35.5 86,35 72,35 v71.5,34.5 | v41,11 48,18 v66,18
IO21_SDA  (via drill 0.4)
  Top 0.254: J2.2 87.25,6.02 87.25,14.14 R16.2 85.74,15.74 86.5,16.5 86.5,18.5 85.5,19.5 v76,19.5 75,19.5 73.97,20.52 IC1.1 | v64,38 64,39 64.65,39.65 IC2.33
  Route15 0.254: v76,19.5 75.5,20 75.5,24.5 74.5,25.5 70,25.5 64,31.5 v64,38 69.5,43.5 86,43.5 92.69,50.19 J11.3
IO22_SCL  (via drill 0.4)
  Top 0.254: J2.1 88.54,14.46 87.5,15.5 87.5,19.76 R17.2 82.8,21.7 82,22.5 77,22.5 75.5,24 v74,24 73.33,23.32 IC1.2 | IC2.36 62.46,43.46 v61,42 | v95.23,48 J11.4
  Route2 0.254: v61,42 63,44 91.23,44 v95.23,48
  Route15 0.254: v74,24 69,24 60,33 60,41 v61,42
IO23_COPI  (via drill 0.4)
  Top 0.254: J10.3 44.74,4.76 45,4.5 55,4.5 56.5,3 62.54,3 J1.4 | IC4.35 86.75,34.75 v87,34.5 | IC2.37 68.27,44.73 69,44 69,38 71.4,35.6 72.4,35.6 73,35 v73,34
  Route2 0.254: v73,34 73,8 68,3 66,3 J1.4
  Bottom 0.254: v73,34 73.5,34.5 v87,34.5
IO25_TFT_CS  (via drill 0.4)
  Top 0.254: IC2.10 45.07,34.57 44,33.5 44,29 56.5,16.5 v56.5,8.5
  Bottom 0.254: v56.5,8.5 56.5,7.42 J1.8
IO26_WIZ_CS  (via drill 0.4)
  Top 0.254: IC4.32 86.25,36.25 87,37 v87,37.5 | v53.5,33.5 49.4,33.5 IC2.11
  Bottom 0.254: v87,37.5 86,37.5 84.5,36 63,36 60.5,33.5 v53.5,33.5
IO32_SCL2  (via drill 0.4)
  Top 0.254: IC2.8 49.09,37 v47,37
  Route2 0.254: v47,37 47,40 51,44 61,44 62.5,45.5 68.5,45.5 70.5,47.5 82.5,47.5 84.5,49.5 97.81,49.5 J11.6
IO33_SDA2  (via drill 0.4)
  Top 0.254: v46,38 46,36.5 46.66,35.84 IC2.9
  Route2 0.254: J11.5 95.77,50 84,50 82,48 70,48 68,46 62,46 60.5,44.5 50.5,44.5 46,40 v46,38
IO34_WIZ_INT  (via drill 0.4)
  Top 0.254: R22.1 45.18,39.65 IC2.6 51.35,39.65 v52,39 | IC4.36 84.05,33.55 v83.5,33
  Bottom 0.254: v83.5,33 75,33 73,31 54,31 52,33 v52,39
LINKLED  (via drill 0.4)
  Top 0.254: IC4.25 82.25,39.75 81,38.5 81,37.5 80.5,37 v78,37 R8.1 | v72,37 70.5,38.5 v70.5,45 | R13.2 v100,46.5
  Bottom 0.254: v70.5,45 80,45 81.5,46.5 v100,46.5 | v72,37 v78,37
N$1  (via drill 0.4)
  Top 0.254: C5.1 R3.1 R4.1 v98,33.5
  Bottom 0.254: U1.P$3 98.33,33.83 v98,33.5
N$2
  Top 0.254: R15.1 LED7.A
N$3
  Top 0.254: Q2.2 104,4 103.5,3.5 102.26,3.5 R25.2
N$4
  Top 0.254: R19.2 110.51,13.75 J3.B5
N$5
  Top 0.254: R14.1 104.74,24 J6.1
N$6
  Top 0.254: J3.A5 110.99,10.75 R18.2
N$7
  Top 0.254: Q2.5 104,3 104.5,3.5 105.74,3.5 R24.2
N$8
  Top 0.813: D2.A 21.15,22.15 18,19 5,19 2.49,16.49 VR2.6
  Bottom 0.813: VR2.6 2.49,11 10.49,3 J8.2
N$9
  Top 0.305: R16.1 83.26,17.26 81.23,15.23 J5.1
N$10
  Top 0.254: C2.1 80.26,29.21 XTL1.3 81.5,30.45 81.5,33 81,33.5 | R31.1 81,33.5 | IC4.31 83.18,36.75 82.97,36.54 82.97,35.47 81,33.5
N$11
  Top 0.305: R17.1 85.02,23.77 J7.2
N$12
  Top 0.305: R21.2 R20.1 91.76,18.76 92.5,19.5 92.5,21 92.14,21.36 IC3.3
N$18
  Top 0.406: IC3.6 IC3.7 98.58,22.64 Q1.1
N$19
  Top 0.305: IC3.1 92.59,23.91 93.5,23 93.5,20.5 93.91,20.09 IC3.5
N$21
  Top 0.254: R11.2 LED3.C
N$22
  Top 0.254: R10.2 LED4.C
N$26
  Top 0.254: LED6.C R7.2
N$27
  Top 0.254: C1.1 77.39,31.65 XTL1.1 78.77,31.82 R31.2 78.74,34.74 79,35 81.5,35 82.5,36 82.5,37 82.75,37.25 IC4.30
N$28
  Top 0.254: LED2.C R8.2
N$31
  Top 0.254: IC4.20 87.75,43.49 C16.1
N$32
  Top 0.254: U1.P$4 106.56,35 C6.1 R1.2
N$33
  Top 0.254: IC4.10 94.01,38.75 R26.1
N$34
  Top 0.254: IC4.23 86.23,41.47 86.23,42.34 86.04,42.53 85.47,42.53 84,44 R23.1
N$36
  Top 0.254: IC4.45 89.75,31.68 89.96,31.47 90.5,31.47 91.2,30.77 RN1.1
N$37
  Top 0.254: IC4.44 89.25,31.41 89.66,31 90,31 90.4,30.6 RN1.2
N$38
  Top 0.254: RN1.3 89.6,30.42 88.75,31.27 IC4.43
N$39
  Top 0.254: IC4.42 88.25,30.73 RN1.4
N$40
  Top 0.254: IC4.41 87.75,30.73 RN2.1
N$41
  Top 0.254: IC4.40 87.25,31.27 86.4,30.42 RN2.2
N$42
  Top 0.254: IC4.39 86.75,31.41 86.34,31 86,31 85.6,30.6 RN2.3
N$43
  Top 0.254: IC4.38 86.25,31.68 86.04,31.47 85.5,31.47 84.8,30.77 RN2.4
N$45
  Top 0.254: IC5.8 103.75,15.25 103.5,15.5 R29.1 R30.2
N$60
  Top 0.813: D1.A 7,39.15 J4.1
N$67
  Top 0.254: R12.1 107.26,47 113.7,47 U1.P$14
N$327
  Top 0.254: LED5.C R6.2
N$329
  Top 0.254: LED1.C R9.2
N$332
  Top 0.254: U1.P$12 116,34 113,34 110,37 110,41.76 107.88,43.88 107.76,44 106.76,45 104,45 102.24,43.24 R13.1
POEV+
  Bottom 0.813: U1.P$9 104.06,41.5 69,41.5 67,43.5 40.5,43.5 32.5,35.5 15,35.5 13.5,34 13.5,27 18.5,22 32.5,22 35.51,18.99 VR2.1 35.51,12.51 33.5,10.5 19.5,10.5 17.27,8.27 J8.1
POEV-
  Top 0.813: VR2.2 32.97,9.7 J9.1
  Bottom 0.813: U1.P$10 105.86,43.5 69.5,43.5 67.5,45.5 39,45.5 31,37.5 14,37.5 11.5,35 11.5,26 20,17.5 32,17.5 32.97,16.53 VR2.2
RTS
  Top 0.254: Q2.4 101.69,2.55 R25.1 100.76,2.74 100.5,3 100.5,10 101,10.5 101.65,10.5 IC5.19
RX_LED
  Top 0.254: IC5.13 99.75,13.75 99,14.5 96.74,14.5 R10.1
RXD0  (via drill 0.4)
  Top 0.254: IC5.21 102.75,9.55 v101.7,8.5 | IC2.34 63.92,40.92 v63,40
  Route2 0.254: v63,40 90,40 96,34 96,11 98.5,8.5 v101.7,8.5
RXIN  (via drill 0.4)
  Top 0.254: IC4.5 91.75,36.25 91.5,36 v90.99,36 | R4.2 101.71,32.55 U1.P$2
  Bottom 0.254: v90.99,36 91.06,35.92 93.08,35.92 98.97,30.03 105.38,30.03 106.65,31.3 U1.P$2
RXIP  (via drill 0.4)
  Top 0.254: IC4.6 90.75,36.75 v90.5,37 | R3.2 103.39,32 U1.P$1
  Bottom 0.254: U1.P$1 98.61,31.29 92.96,36.93 90.57,36.93 v90.5,37
SPDLED
  Top 0.254: IC4.24 81.95,41.45 81,40.5 81,39.24 R7.1
TX_LED
  Top 0.254: IC5.14 98.51,13.25 R11.1
TXD0  (via drill 0.4)
  Top 0.254: IC2.35 63.19,42.19 v62,41 | IC5.20 102.25,10.16 101.59,9.5 v101.4,9.5
  Route2 0.254: v62,41 90.5,41 97,34.5 97,11 98.5,9.5 v101.4,9.5
TXON  (via drill 0.4)
  Top 0.254: v93,33.5 93,34.2 IC4.1 | R2.1 102,39.5 102.5,40 105,40 106.65,38.35 U1.P$6
  Bottom 0.254: v93,33.5 90.96,33.5 89,35.46 89,37.78 91.36,40.13 104.65,40.13 106.65,38.13 U1.P$6
TXOP  (via drill 0.4)
  Top 0.254: IC4.2 91.25,34.75 v91,34.5 | R5.1 102.47,38 U1.P$5
  Bottom 0.254: U1.P$5 102.36,38.12 90.1,38.12 89.5,37.52 89.5,36 v91,34.5
USBVCC
  Top 0.406: F1.2 112.95,23.95 111,22 Q1.3
USBVIN  (via drill 0.4)
  Top 0.406: J3.A9B4 112.05,14.45 | 112.05,14.45 v112,14.5 | J3.A4B9 113.36,9.5 v112,9.5 | F1.1 115.45,20 113,20 112.05,19.05 112.05,14.45
  Bottom 0.406: v112,9.5 v112,14.5

### Text on the board
tPlace: 3.3V | GND | SDA | SCL | SDA2 | SCL2 | TX2 | RX2 | INPUT: / 12Vdc | ACT | FDX | LNK | 100 | RESET | A squirrel is / eating the / vreg! | 3.3V | Universal / Rack / Controller | ESP32 Edition | Super / House | I2C P/U | LED | MICRO SD | www.superhouse.tv/urc | SPI LCD | I2CBR | RX | TX | PoE BYPASS | v1.0
bPlace: 3.3V | GND | IO21_SDA | IO22_SCL | IO33_SDA2 | IO32_SCL2 | IO17_TX2 | IO16_RX2 | Copyright 2021 SuperHouse Automation P/L / Released under the TAPR / Open Hardware License / tapr.org/OHL | MCP9808 I2C Addr: 0x18 | TFT_BLK | TFT_RST | SCLK | GND | 3.3V | 12V | SCL | CS | DC | COPI | 3.3V | RST | GND | SDA
Measures: Universal Rack Controller PCB v1.0 Mechanical Outline
tDocu: A | A | A | A | K | K | K | K